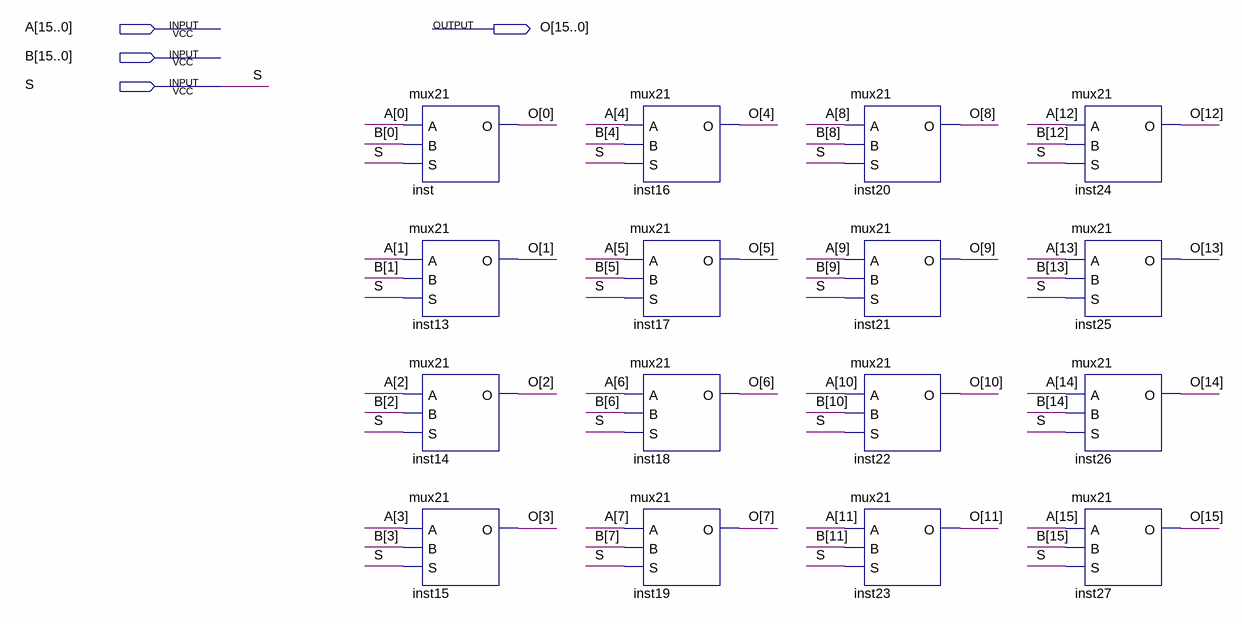
[diagram p0: schematic sheet]
// Quartus schematic mux21_16bit.bdf as structural Verilog: 16 symbols, 4 pins
module mux21_16bit (
  input  [15:0] A,
  input  [15:0] B,
  input  S,
  output [15:0] O
);

  mux21 inst (.A(A[0]), .B(B[0]), .S(S), .O(O[0]));
  mux21 inst13 (.A(A[1]), .B(B[1]), .S(S), .O(O[1]));
  mux21 inst14 (.A(A[2]), .B(B[2]), .S(S), .O(O[2]));
  mux21 inst15 (.A(A[3]), .B(B[3]), .S(S), .O(O[3]));
  mux21 inst16 (.A(A[4]), .B(B[4]), .S(S), .O(O[4]));
  mux21 inst17 (.A(A[5]), .B(B[5]), .S(S), .O(O[5]));
  mux21 inst18 (.A(A[6]), .B(B[6]), .S(S), .O(O[6]));
  mux21 inst19 (.A(A[7]), .B(B[7]), .S(S), .O(O[7]));
  mux21 inst20 (.A(A[8]), .B(B[8]), .S(S), .O(O[8]));
  mux21 inst21 (.A(A[9]), .B(B[9]), .S(S), .O(O[9]));
  mux21 inst22 (.A(A[10]), .B(B[10]), .S(S), .O(O[10]));
  mux21 inst23 (.A(A[11]), .B(B[11]), .S(S), .O(O[11]));
  mux21 inst24 (.A(A[12]), .B(B[12]), .S(S), .O(O[12]));
  mux21 inst25 (.A(A[13]), .B(B[13]), .S(S), .O(O[13]));
  mux21 inst26 (.A(A[14]), .B(B[14]), .S(S), .O(O[14]));
  mux21 inst27 (.A(A[15]), .B(B[15]), .S(S), .O(O[15]));
endmodule
